# Altium schematic sheet VAC_Sense.SchDoc (part 1 of 3)
size A2 portrait; SheetNumber: 4; SheetTotal: 4
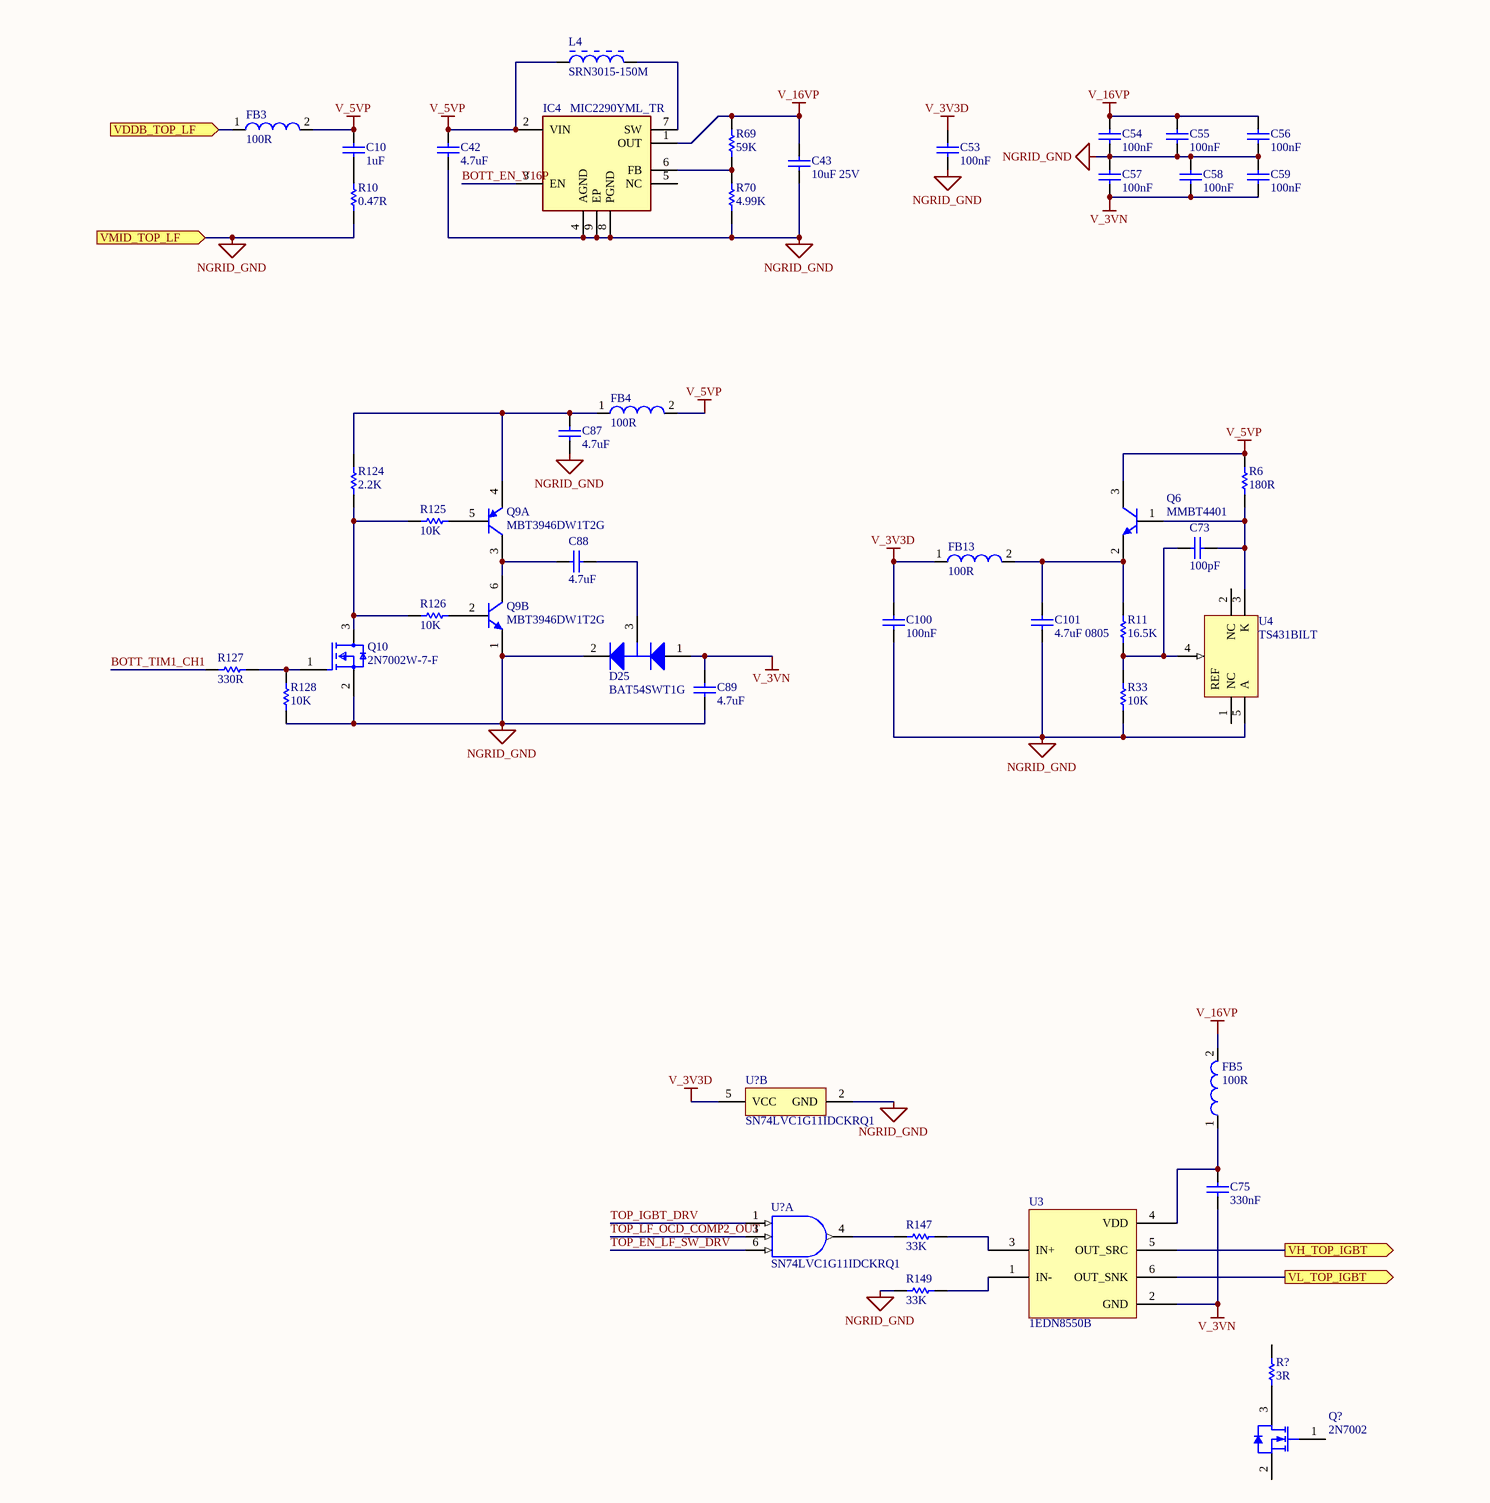
[diagram p0: VAC_Sense.SchDoc, top]
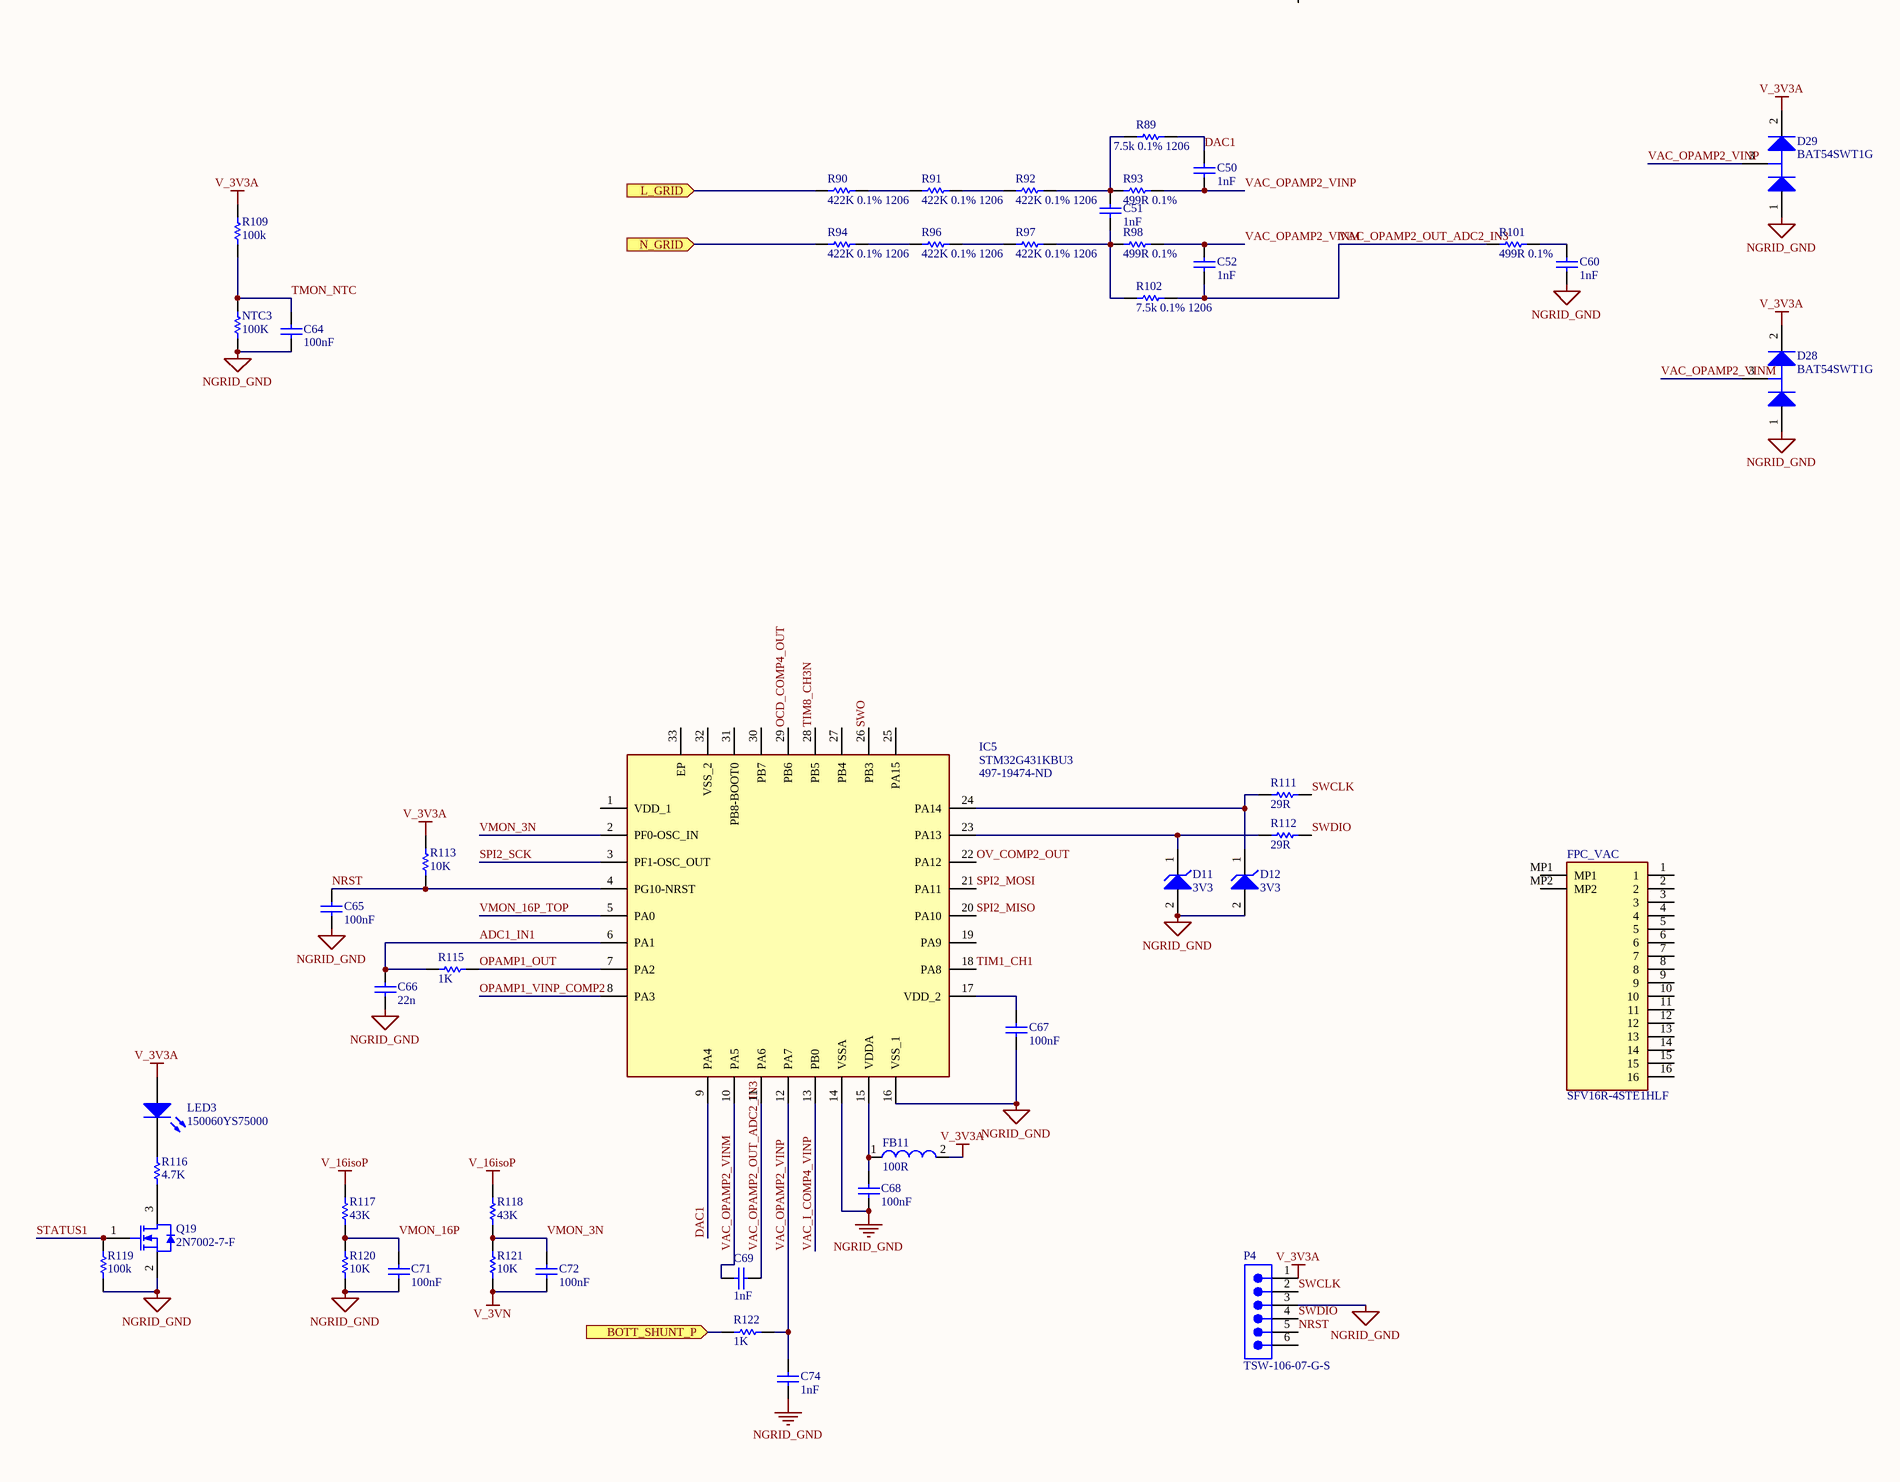
[diagram p1: VAC_Sense.SchDoc, bottom]

## Parts
(Parts that share a designator on the sheet are numbered #1, #2 ... from top to bottom, then left to right.)
C10  1uF  [CAPC2013X140X50LL20T25]
C42  4.7uF  [CAPC2013X145X20NL20]
C43  10uF 25V  [CAPC3216X229X50LL20T25]
C50  1nF  [CAPC1608X90X35NL15T15]
C51  1nF  [CAPC1608X90X35NL15T15]
C52  1nF  [CAPC1608X90X35NL15T15]
C53  100nF  [CAPC1608X90X35ML15T15]
C54  100nF  [CAPC1608X90X35NL15T15]
C55  100nF  [CAPC1608X90X35NL15T15]
C56  100nF  [CAPC1608X90X35NL15T15]
C57  100nF  [CAPC1608X90X35NL15T15]
C58  100nF  [CAPC1608X90X35NL15T15]
C59  100nF  [CAPC1608X90X35NL15T15]
C60  1nF  [CAPC1608X90X35NL15T15]
C64  100nF  [CAPC1608X90X35ML15T15]
C65  100nF  [CAPC1608X90X35NL15T15]
C66  22n  [CAPC2013X135X45ML10T25]
C67  100nF  [SAMS-C0603-2_N]
C68  100nF  [SAMS-C0603-2_N]
C69  1nF  [CAPC1608X90X35NL15T15]
C71  100nF  [CAPC1608X90X35ML15T15]
C72  100nF  [CAPC1608X90X35ML15T15]
C73  100pF  [CAPC1608X90X35NL10T15]
C74  1nF  [CAPC1608X90X35NL15T15]
C75  330nF  [CAPC2013X135X45ML10T25]
C87  4.7uF  [SAMS-C0603-2_L]
C88  4.7uF  [SAMS-C0603-2_L]
C89  4.7uF  [SAMS-C0603-2_L]
C100  100nF  [SAMS-C0603-2_N]
C101  4.7uF 0805  [CAPC2013X145X20NL20]
D11  3V3  [ONSC-SOD-523-2-502-01_V]
D12  3V3  [ONSC-SOD-523-2-502-01_V]
D25  BAT54SWT1G  [ONSC-SOT-323-3-419-04_V]
D28  BAT54SWT1G  [ONSC-SOT-323-3-419-04_V]
D29  BAT54SWT1G  [ONSC-SOT-323-3-419-04_V]
FB3  100R  [SMD-0603]
FB4  100R  [SMD-0603]
FB5  100R  [SMD-0603]
FB11  100R  [SMD-0603]
FB13  100R  [SMD-0603]
FPC_VAC  SFV16R-4STE1HLF  [SFV16R4STE1HLF]
IC4  MIC2290YML_TR  [SON50P200X200X95-9N-D]
IC5  STM32G431KBU3  Supplier Part Number 1: 497-19474-ND  [QFN50P500X500X60-33N-D]
L4  SRN3015-150M  [BOUR-SRN3015-2_V]
LED3  150060YS75000  [0603_A]
NTC3  100K  [RESC1608X100X25ML20T15]
P4  TSW-106-07-G-S  [SMTC-TSW-106-07-X-S]
Q6  MMBT4401  [FAIR-SOT23-3_V]
Q9  MBT3946DW1T2G  [ONSC-SC70-6-419B-02_W_V]  (parts A,B of 2)
Q10  2N7002W-7-F  [FP-SOT323-IPC_C]
Q19  2N7002-7-F  [DIOD-SOT23-3_V]
Q?  2N7002  [STM-SOT-23-3_V]
R6  180R  [RESC1608X55X25LL10T15]
R10  0.47R  [RESC1608X55X25ML10T15]
R11  16.5K  [RESC1608X55X30NL15T15]
R33  10K  [RESC1609X55X30LL15T15]
R69  59K  [RESC1608X55X30NL15T15]
R70  4.99K  [RESC1609X50X30NL10T20]
R89  7.5k 0.1% 1206  [RESC3216X50X50NL20T20]
R90  422K 0.1% 1206  [RESC1206(3216)_N]
R91  422K 0.1% 1206  [RESC1206(3216)_N]
R92  422K 0.1% 1206  [RESC1206(3216)_N]
R93  499R 0.1%  [RESC1608X55X30LL20T20]
R94  422K 0.1% 1206  [RESC1206(3216)_N]
R96  422K 0.1% 1206  [RESC1206(3216)_N]
R97  422K 0.1% 1206  [RESC1206(3216)_N]
R98  499R 0.1%  [RESC1608X55X30LL20T20]
R101  499R 0.1%  [RESC1608X55X30LL20T20]
R102  7.5k 0.1% 1206  [RESC3216X50X50NL20T20]
R109  100k  [RESC1608X55X25ML10T15]
R111  29R  [RESC1608X55X30NL20T10]
R112  29R  [RESC1608X55X30NL20T10]
R113  10K  [RESC1608X55X30NL20T10]
R115  1K  [RESC1608X55X30NL20T10]
R116  4.7K  [RESC1608X55X25ML10T15]
R117  43K  [RESC1608X55X30NL20T10]
R118  43K  [RESC1608X55X30NL20T10]
R119  100k  [RESC1608X55X25ML10T15]
R120  10K  [RESC1608X55X30NL20T10]
R121  10K  [RESC1608X55X30NL20T10]
R122  1K  [RESC1608X55X30NL20T10]
R124  2.2K  [RESC1608X55X25NL10T15]
R125  10K  [RESC1608X55X30NL20T10]
R126  10K  [RESC1608X55X30NL20T10]
R127  330R  [RESC1608X55X25NL10T15]
R128  10K  [RESC1608X55X30NL20T10]
R147  33K  [RESC1005X40X25ML05T05]
R149  33K  [RESC1005X40X25ML05T05]
R?  3R  [RESC1005X40X25ML05T05]
U3  1EDN8550B  [SOT23-6]
U4  TS431BILT  [SOT23-5_N]
U?#1  SN74LVC1G11IDCKRQ1  [DCK0006A_M]  (part B of 2)
U?#2  SN74LVC1G11IDCKRQ1  [DCK0006A_M]  (part A of 2)

## Ports
BOTT_SHUNT_P (in), L_GRID (in), N_GRID (in), VDDB_TOP_LF (in), VH_TOP_IGBT (out), VL_TOP_IGBT (out), VMID_TOP_LF (in)

## Nets
NGRID_GND: C42.1 C43.1 C53.1 C54.1 C55.1 C56.1 C57.2 C58.2 C59.2 C60.2 C64.1 C65.1 C66.1 C67.1 C68.1 C71.1 C74.1 C87.1 C89.1 C100.1 C101.1 D11.2(A) D12.2(A) D25.2(K) D28.1(A) D29.1(A) IC4.4(AGND) IC4.8(PGND) IC4.9(EP) IC5.14(VSSA) IC5.16(VSS_1) NTC3.1 P4.3 Q9.1(E) Q10.2(S) Q19.2(S) R10.1 R33.1 R70.1 R119.1 R120.2 R128.1 R149.1 U4.5(A) U?#1.2(GND) ; port VMID_TOP_LF
V_3V3A: D28.2(K) D29.2(K) FB11.2 LED3.2(A) P4.1 R109.2 R113.1
V_3V3D: C53.2 C100.2 FB13.1 U?#1.5(VCC)
V_3VN: C57.1 C58.1 C59.1 C72.1 C75.1 C89.2 D25.1(A) R121.2 U3.2(GND)
V_5VP: C10.2 C42.2 FB3.2 FB4.2 IC4.2(VIN) L4.1 Q6.3(C) R6.2
V_16isoP: R117.1 R118.1
V_16VP: C43.2 C54.2 C55.2 C56.2 FB5.2 IC4.1(OUT) R69.2
ADC1_IN1: C66.2 IC5.6(PA1) R115.2
BOTT_EN_V16P: IC4.3(EN)
BOTT_SHUNT_P: R122.2 ; port BOTT_SHUNT_P
BOTT_TIM1_CH1: R127.1
DAC1: C50.2 IC5.9(PA4) R89.1
L_GRID: R90.2 ; port L_GRID
N_GRID: R94.2 ; port N_GRID
NRST: C65.2 IC5.4(PG10-NRST) P4.5 R113.2
OCD_COMP4_OUT: IC5.29(PB6)
OPAMP1_OUT: IC5.7(PA2) R115.1
OPAMP1_VINP_COMP2: IC5.8(PA3)
OV_COMP2_OUT: IC5.22(PA12)
SPI2_MISO: IC5.20(PA10)
SPI2_MOSI: IC5.21(PA11)
SPI2_SCK: IC5.3(PF1-OSC_OUT)
STATUS1: Q19.1(G) R119.2
SWCLK: P4.2 R111.2
SWDIO: P4.4 R112.2
SWO: IC5.26(PB3)
TIM1_CH1: IC5.18(PA8)
TIM8_CH3N: IC5.28(PB5)
TMON_NTC: C64.2 NTC3.2 R109.1
TOP_EN_LF_SW_DRV: U?#2.6(C)
TOP_IGBT_DRV: U?#2.1(A)
TOP_LF_OCD_COMP2_OUT: U?#2.3(B)
VAC_I_COMP4_VINP: IC5.13(PB0)
VAC_OPAMP2_OUT_ADC2_IN3: C52.2 C69.1 IC5.11(PA6) R101.1 R102.1
VAC_OPAMP2_VINM: C52.1 C69.2 D28.3(K/A) IC5.10(PA5) R98.2
VAC_OPAMP2_VINP: C50.1 C74.2 D29.3(K/A) IC5.12(PA7) R93.2 R122.1
VDDB_TOP_LF: FB3.1 ; port VDDB_TOP_LF
VH_TOP_IGBT: U3.5(OUT_SRC) ; port VH_TOP_IGBT
VL_TOP_IGBT: U3.6(OUT_SNK) ; port VL_TOP_IGBT
VMON_3N: C72.2 IC5.2(PF0-OSC_IN) R118.2 R121.1
VMON_16P: C71.2 R117.2 R120.1
VMON_16P_TOP: IC5.5(PA0)
NetC10_1: C10.1 R10.2
NetC51_1: C51.1 R97.1 R98.1 R102.2
NetC51_2: C51.2 R89.2 R92.1 R93.1
NetC60_1: C60.1 R101.2
NetC67_2: C67.2 IC5.17(VDD_2)
NetC68_2: C68.2 FB11.1 IC5.15(VDDA)
NetC73_1: C73.1 R11.1 R33.2 U4.4(REF)
NetC73_2: C73.2 Q6.1(B) R6.1 U4.3(K)
NetC75_2: C75.2 FB5.1 U3.4(VDD)
NetC87_2: C87.2 FB4.1 Q9.4(E) R124.2
NetC88_1: C88.1 D25.3(K/A)
NetC88_2: C88.2 Q9.3(C) Q9.6(C)
NetC101_2: C101.2 FB13.2 Q6.2(E) R11.2
NetD11_1: D11.1(K) IC5.23(PA13) R112.1
NetD12_1: D12.1(K) IC5.24(PA14) R111.1
NetIC4_6: IC4.6(FB) R69.1 R70.2
NetIC4_7: IC4.7(SW) L4.2
NetLED3_1: LED3.1(K) R116.2
NetQ9_2: Q9.2(B) R126.2
NetQ9_5: Q9.5(B) R125.2
NetQ10_1: Q10.1(G) R127.2 R128.2
NetQ10_3: Q10.3(D) R124.1 R125.1 R126.1
NetQ19_3: Q19.3(D) R116.1
NetQ?_3: Q?.3(D) R?.1
NetR90_1: R90.1 R91.2
NetR91_1: R91.1 R92.2
NetR94_1: R94.1 R96.2
NetR96_1: R96.1 R97.2
NetR147_1: R147.1 U?#2.4(Y)
NetR147_2: R147.2 U3.3(IN+)
NetR149_2: R149.2 U3.1(IN-)

Not connected (* = marked no-connect by the designer): FPC_VAC 1 2 3 4 5 6 7 8 9 10 11 12 13 14 15 16 MP1 MP2; IC4 5(NC); IC5 1(VDD_1) 19(PA9) 25(PA15) 27(PB4) 30(PB7) 31(PB8-BOOT0) 32(VSS_2) 33(EP); P4 6; Q? 1(G) 2(S); R? 2; U4 1(NC) 2(NC)